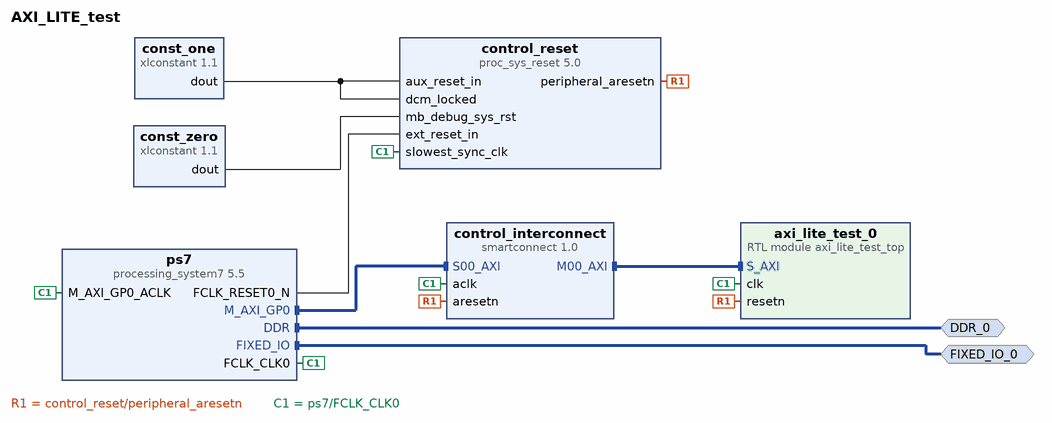
[diagram p0: block diagram of the top level]
# Vivado block design AXI_LITE_test, xc7z020clg484-1, Vivado 2025.2
create_bd_design AXI_LITE_test

create_bd_intf_port -mode Master -vlnv xilinx.com:interface:ddrx_rtl:1.0 DDR_0
create_bd_intf_port -mode Master -vlnv xilinx.com:display_processing_system7:fixedio_rtl:1.0 FIXED_IO_0

create_bd_cell -type ip -vlnv xilinx.com:ip:processing_system7:5.5 ps7
set_property -dict [list \
  CONFIG.PCW_ENET0_ENET0_IO {MIO 16 .. 27} \
  CONFIG.PCW_ENET0_GRP_MDIO_ENABLE 1 \
  CONFIG.PCW_ENET0_GRP_MDIO_IO {MIO 52 .. 53} \
  CONFIG.PCW_ENET0_PERIPHERAL_ENABLE 1 \
  CONFIG.PCW_ENET0_RESET_ENABLE 1 \
  CONFIG.PCW_ENET0_RESET_IO {MIO 47} \
  CONFIG.PCW_ENET_RESET_ENABLE 1 \
  CONFIG.PCW_ENET_RESET_SELECT {Share reset pin} \
  CONFIG.PCW_FPGA0_PERIPHERAL_FREQMHZ 100 \
  CONFIG.PCW_FPGA1_PERIPHERAL_FREQMHZ 50 \
  CONFIG.PCW_GPIO_MIO_GPIO_ENABLE 1 \
  CONFIG.PCW_GPIO_MIO_GPIO_IO MIO \
  CONFIG.PCW_I2C_RESET_ENABLE 1 \
  CONFIG.PCW_PRESET_BANK1_VOLTAGE {LVCMOS 1.8V} \
  CONFIG.PCW_QSPI_PERIPHERAL_ENABLE 0 \
  CONFIG.PCW_SD0_GRP_CD_ENABLE 1 \
  CONFIG.PCW_SD0_GRP_CD_IO {MIO 0} \
  CONFIG.PCW_SD0_GRP_WP_ENABLE 0 \
  CONFIG.PCW_SD0_PERIPHERAL_ENABLE 1 \
  CONFIG.PCW_SD0_SD0_IO {MIO 40 .. 45} \
  CONFIG.PCW_SDIO_PERIPHERAL_FREQMHZ 100 \
  CONFIG.PCW_UART1_PERIPHERAL_ENABLE 1 \
  CONFIG.PCW_UART1_UART1_IO {MIO 48 .. 49} \
  CONFIG.PCW_UART_PERIPHERAL_FREQMHZ 100 \
  CONFIG.PCW_UIPARAM_DDR_PARTNO {MT41K256M16 RE-15E} \
  CONFIG.PCW_USB0_PERIPHERAL_ENABLE 0 \
  CONFIG.PCW_USB_RESET_ENABLE 1 \
] [get_bd_cells ps7]
# 231 more settings of ps7 are not shown: defaults, MIO pin electricals, DDR timing, and values the tool derives
create_bd_cell -type ip -vlnv xilinx.com:ip:smartconnect:1.0 control_interconnect
set_property -dict {CONFIG.NUM_MI 1 CONFIG.NUM_SI 1} [get_bd_cells control_interconnect]
create_bd_cell -type module -reference axi_lite_test_top axi_lite_test_0
create_bd_cell -type ip -vlnv xilinx.com:ip:proc_sys_reset:5.0 control_reset
create_bd_cell -type ip -vlnv xilinx.com:ip:xlconstant:1.1 const_one
set_property -dict {CONFIG.CONST_VAL 1} [get_bd_cells const_one]
create_bd_cell -type ip -vlnv xilinx.com:ip:xlconstant:1.1 const_zero
set_property -dict {CONFIG.CONST_VAL 0} [get_bd_cells const_zero]

# ---- connections ----

connect_bd_intf_net [get_bd_intf_pins control_interconnect/M00_AXI] [get_bd_intf_pins axi_lite_test_0/S_AXI]
connect_bd_intf_net [get_bd_intf_ports DDR_0] [get_bd_intf_pins ps7/DDR]
connect_bd_intf_net [get_bd_intf_ports FIXED_IO_0] [get_bd_intf_pins ps7/FIXED_IO]
connect_bd_intf_net [get_bd_intf_pins ps7/M_AXI_GP0] [get_bd_intf_pins control_interconnect/S00_AXI]
connect_bd_net [get_bd_pins const_one/dout] [get_bd_pins control_reset/dcm_locked] [get_bd_pins control_reset/aux_reset_in]
connect_bd_net [get_bd_pins const_zero/dout] [get_bd_pins control_reset/mb_debug_sys_rst]
connect_bd_net [get_bd_pins control_reset/peripheral_aresetn] [get_bd_pins axi_lite_test_0/resetn] [get_bd_pins control_interconnect/aresetn]
connect_bd_net [get_bd_pins ps7/FCLK_CLK0] \
  [get_bd_pins ps7/M_AXI_GP0_ACLK] [get_bd_pins control_interconnect/aclk] [get_bd_pins control_reset/slowest_sync_clk] \
  [get_bd_pins axi_lite_test_0/clk]
connect_bd_net [get_bd_pins ps7/FCLK_RESET0_N] [get_bd_pins control_reset/ext_reset_in]

# ---- address map ----
assign_bd_address -offset 0x43C00000 -range 4K -target_address_space [get_bd_addr_spaces ps7/Data] [get_bd_addr_segs axi_lite_test_0/S_AXI/reg0]

validate_bd_design
save_bd_design
